# Altium schematic sheet TL750M Application.SchDoc
size A
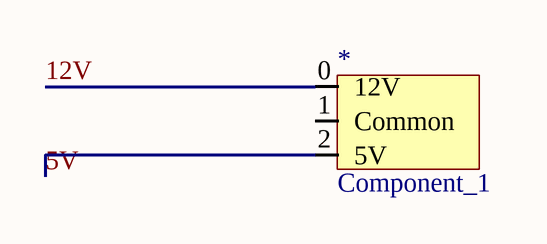
[diagram p0: TL750M Application.SchDoc]

## Parts
*  Component_1  [PCBComponent_1]

## Nets
5V: *.2(5V)
12V: *.0(12V)

Not connected (* = marked no-connect by the designer): * 1(Common)